# EAGLE schematic rfIMU (EAGLE 7.6.0)
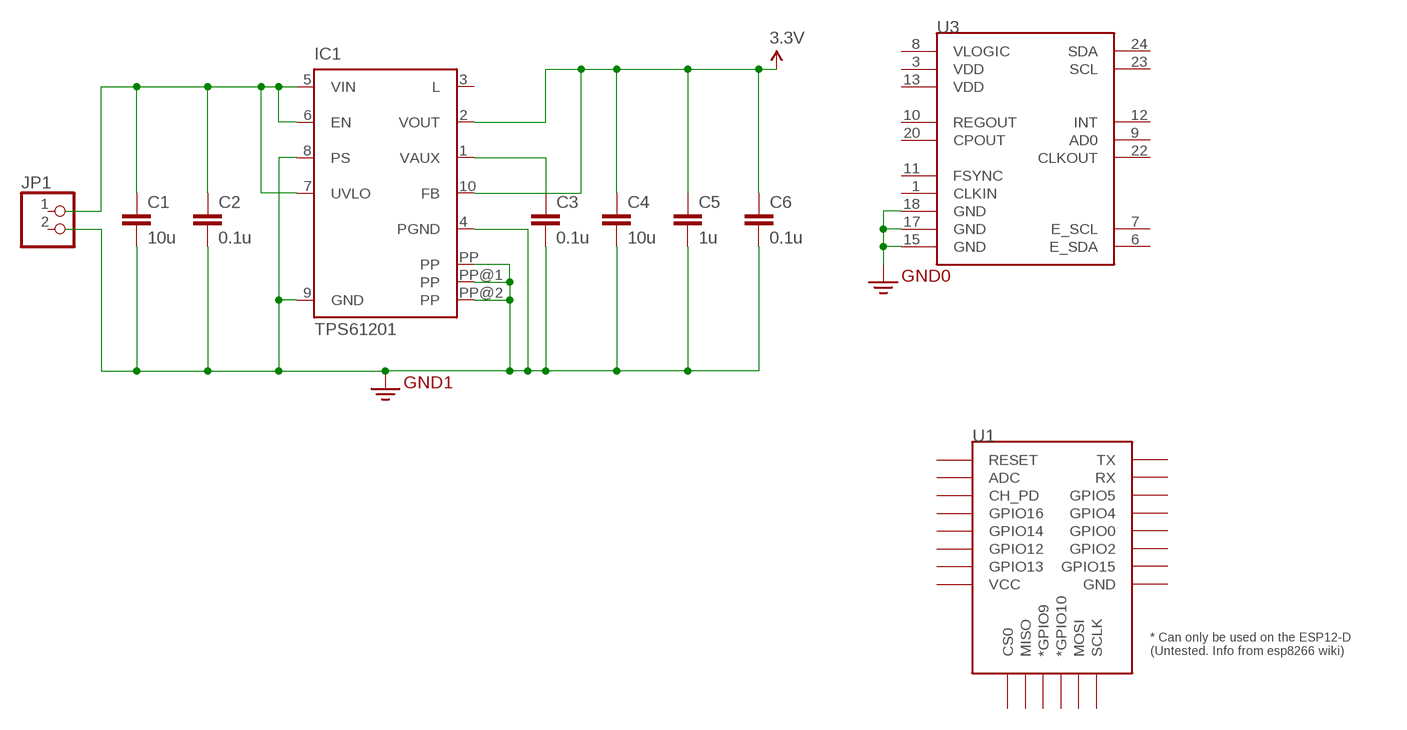
[diagram p0: schematic, sheet 1]

## Parts
C1  10u  CAP0603  [0603]
C2  0.1u  CAP0603  [0603]
C3  0.1u  CAP0603  [0603]
C4  10u  CAP0603  [0603]
C5  1u  CAP0603  [0603]
C6  0.1u  CAP0603  [0603]
IC1  TPS61201  [S-PDSO-N10]
JP1  PINHD-1X2  [1X02]
U1  ESP12ESMD  [ESP12E-SMD]
U3  MPU-9150QFN-24-NP  [QFN-24-NP]

## Nets
3.3V: C1.2 C2.2 C3.2 C4.1 C4.2 C5.1 C5.2 C6.1 C6.2 IC1.2(VOUT) IC1.4(PGND) IC1.8(PS) IC1.9(GND) IC1.10(FB) IC1.PP IC1.PP@1(PP) IC1.PP@2(PP) U3.15(GND) U3.17(GND) U3.18(GND) ; supply symbol labelled GND2
N$2: C3.1 IC1.1(VAUX)
N$4: C1.1 C2.1 IC1.5(VIN) IC1.6(EN) IC1.7(UVLO)
Unconnected: IC1.3(L) JP1.1 JP1.2 U1.ADC U1.CH_PD U1.CS0 U1.GND U1.GPIO0 U1.GPIO2 U1.GPIO4 U1.GPIO5 U1.GPIO9(*GPIO9) U1.GPIO10(*GPIO10) U1.GPIO12 U1.GPIO13 U1.GPIO14 U1.GPIO15 U1.GPIO16 U1.MISO U1.MOSI U1.RESET U1.RXD0(RX) U1.SCLK U1.TXD0(TX) U1.VCC U3.1(CLKIN) U3.3(VDD) U3.6(E_SDA) U3.7(E_SCL) U3.8(VLOGIC) U3.9(AD0) U3.10(REGOUT) U3.11(FSYNC) U3.12(INT) U3.13(VDD) U3.20(CPOUT) U3.22(CLKOUT) U3.23(SCL) U3.24(SDA)

## Library data of the parts
C1-C6 = Brendan:CAP
IC1 = texas:TPS6120*: LOW INPUT VOLTAGE SYNCHRONOUS BOOST CONVERTER WITH 1.3-A SWITCHES Source: http://focus.ti.com/lit/ds/symlink/tps61200.pdf; MPN: TPS61201DRCT; OC_FARNELL: unknown; OC_NEWARK: 37M0068
JP1 = pinhead:PINHD-1X2: PIN HEADER
U1 = esp8266modules:ESP12E: ESP12E Module
U3 = SparkFun-Sensors:MPU-9150: 9DOF (3mag, 3accel, 3rotat). I2C interface.